# Altium schematic sheet X-M3P1O5__main_V1.0.SchDoc
size 457 x 406 mm
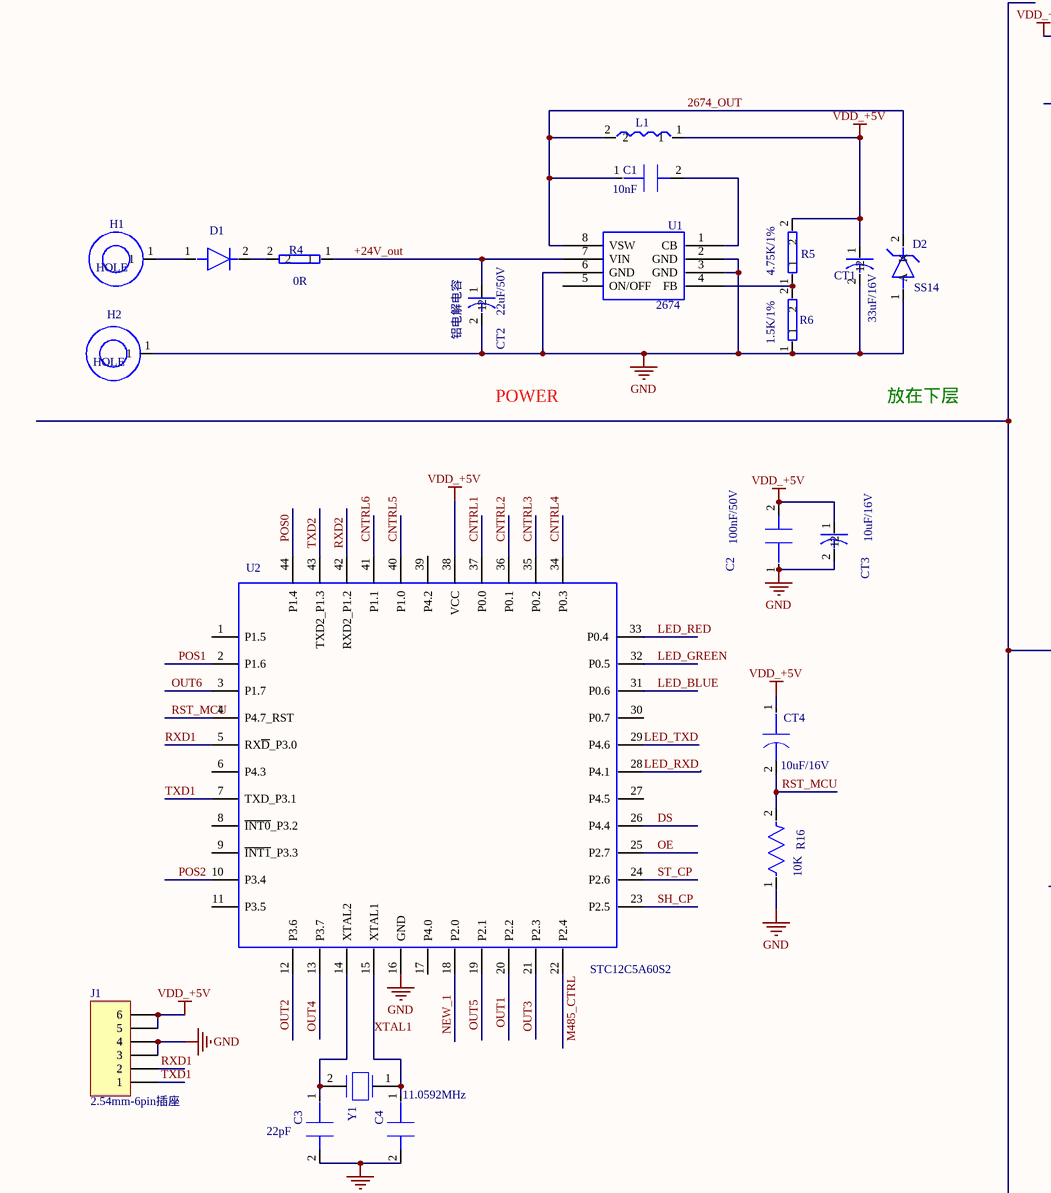
[diagram p0: X-M3P1O5__main_V1.0.SchDoc, top left]
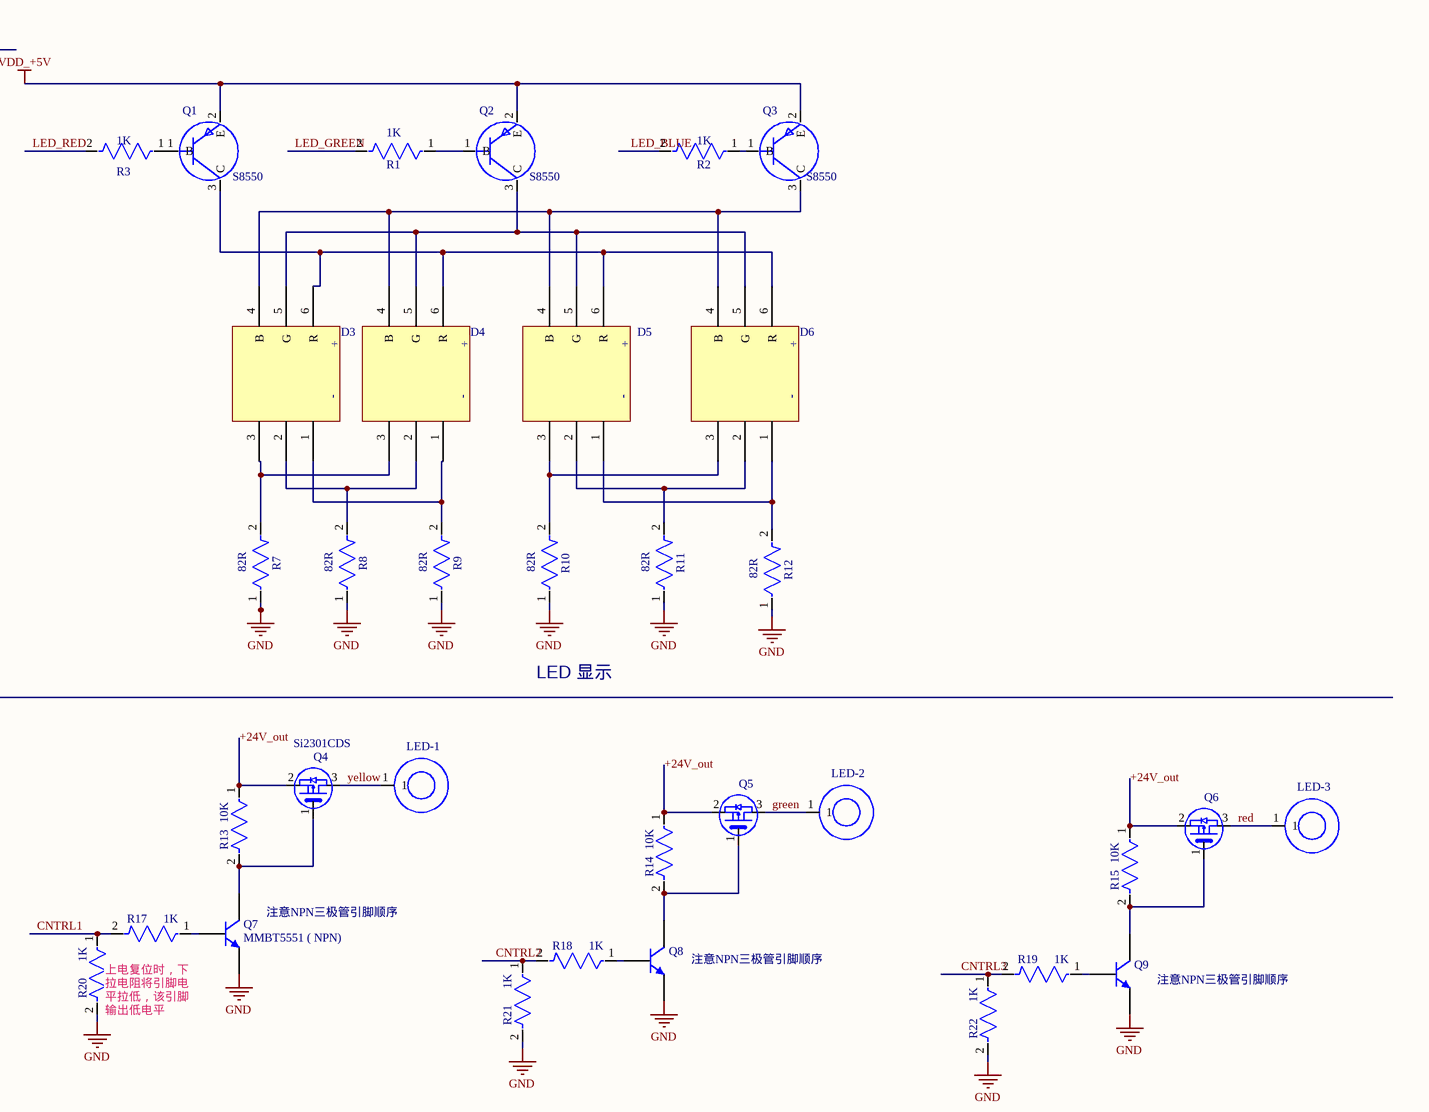
[diagram p1: X-M3P1O5__main_V1.0.SchDoc, top right]
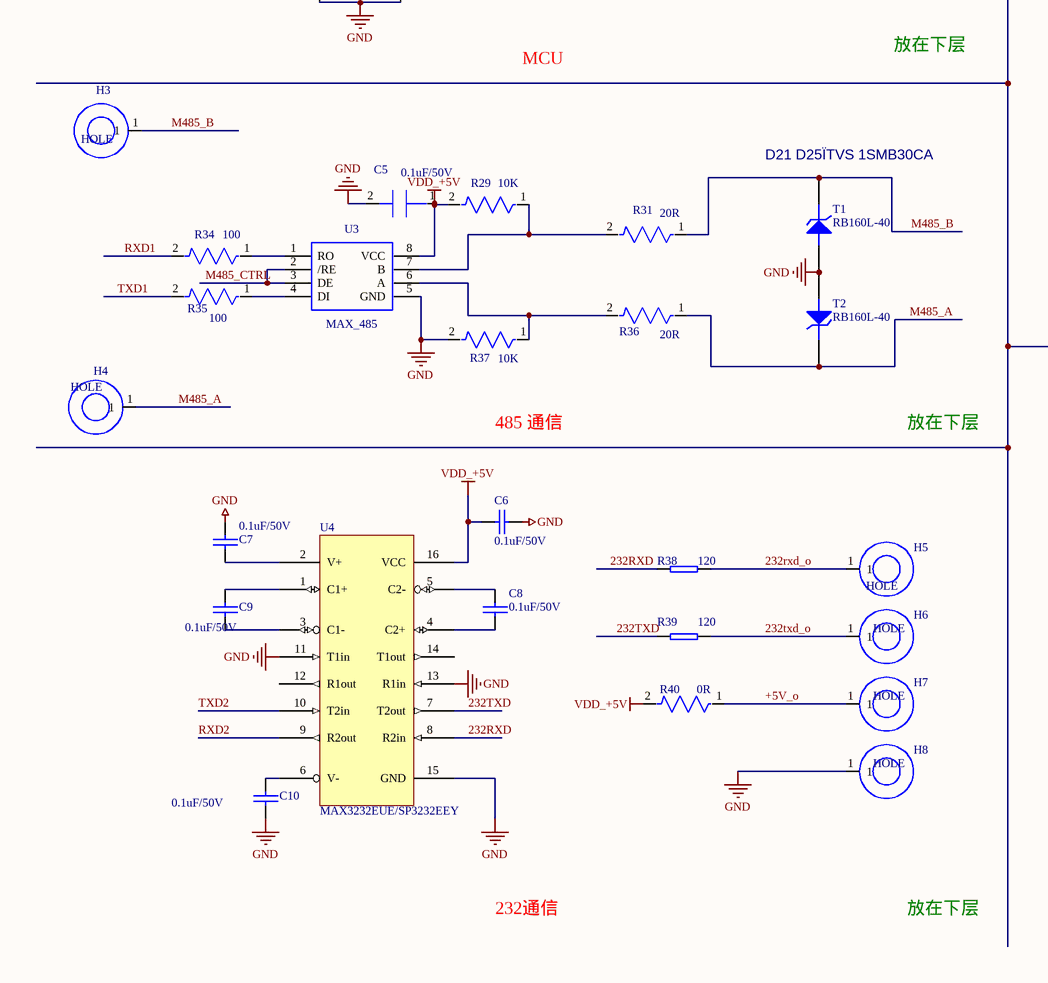
[diagram p2: X-M3P1O5__main_V1.0.SchDoc, bottom left]
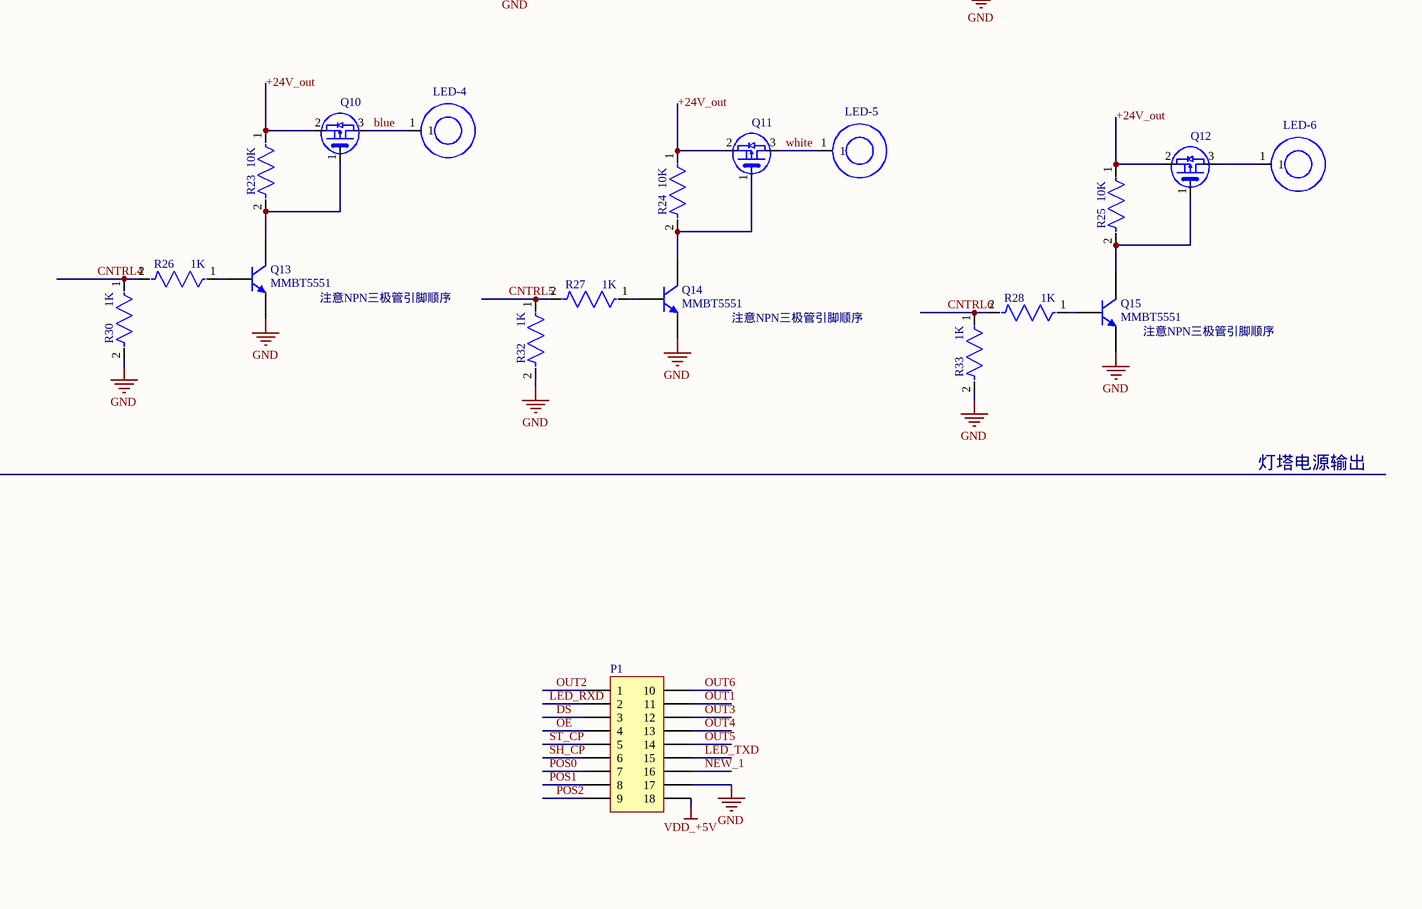
[diagram p3: X-M3P1O5__main_V1.0.SchDoc, bottom right]

## Parts
C1  value 10nF  [C0603]  (hidden comment: CAP0603)
C2  value 100nF/50V  [C0603]  (hidden comment: CAP0603)
C3  value 22pF  [C0603]  (hidden comment: 22pF/50V)
C4  22pF/50V  [C0603]  (value not drawn)
C5  0.1uF/50V  [0603]
C6  0.1uF/50V  [0603]
C7  0.1uF/50V  [0603]
C8  0.1uF/50V  [0603]
C9  0.1uF/50V  [0603]
C10  0.1uF/50V  [0603]
CT1  value 33uF/16V  [CT3528]  (hidden comment: CE)
CT2  铝电解电容  value 22uF/50V  [RB0.1]
CT3  10uF/16V  [1206C]
CT4  10uF/16V  [1206C]
D1  M7  [SMB]  (value not drawn)
D2  SS14  [SMB]
D3  5050RGB  [5050RGB]  (value not drawn)
D4  5050RGB  [5050RGB]  (value not drawn)
D5  5050RGB  [5050RGB]  (value not drawn)
D6  5050RGB  [5050RGB]  (value not drawn)
H1  HOLE  [HOLE_SMD]
H2  HOLE  [HOLE_SMD]
H3  HOLE  [HOLE_SMD]
H4  HOLE  [HOLE_SMD]
H5  HOLE  [HOLE_SMD]
H6  HOLE  [HOLE_SMD]
H7  HOLE  [HOLE_SMD]
H8  HOLE  [HOLE_SMD]
J1  2.54mm-6pin插座  [HDR1X6]
L1  FB  [L-6X6]  (value not drawn)
LED-1  LED_4  [HOLE_SMD]  (value not drawn)
LED-2  LED_4  [HOLE_SMD]  (value not drawn)
LED-3  LED_4  [HOLE_SMD]  (value not drawn)
LED-4  LED_4  [HOLE_SMD]  (value not drawn)
LED-5  LED_4  [HOLE_SMD]  (value not drawn)
LED-6  LED_4  [HOLE_SMD]  (value not drawn)
P1  Header 9X2A  [HDR2X9_CEN]  (value not drawn)
Q1  S8550  [SOT-23]
Q2  S8550  [SOT-23]
Q3  S8550  [SOT-23]
Q4  Si2301CDS  [SOT-23]
Q5  Si2301CDS  [SOT-23]  (value not drawn)
Q6  Si2301CDS  [SOT-23]  (value not drawn)
Q7  MMBT5551 ( NPN)  [SOT-23]
Q8  MMBT5551  [SOT-23]  (value not drawn)
Q9  MMBT5551  [SOT-23]  (value not drawn)
Q10  Si2301CDS  [SOT-23]  (value not drawn)
Q11  Si2301CDS  [SOT-23]  (value not drawn)
Q12  Si2301CDS  [SOT-23]  (value not drawn)
Q13  MMBT5551  [SOT-23]
Q14  MMBT5551  [SOT-23]
Q15  MMBT5551  [SOT-23]
R1  value 1K  [R0603]  (hidden comment: RES0603)
R2  value 1K  [R0603]  (hidden comment: RES0603)
R3  value 1K  [R0603]  (hidden comment: RES0603)
R4  0R  [1206]
R5  4.75K/1%  [R0603]
R6  1.5K/1%  [R0603]
R7  82R  [1206]
R8  82R  [1206]
R9  82R  [1206]
R10  82R  [1206]
R11  82R  [1206]
R12  82R  [1206]
R13  10K  [R0603]
R14  10K  [R0603]
R15  10K  [R0603]
R16  10K  [R0603]
R17  1K  [R0603]
R18  1K  [R0603]
R19  1K  [R0603]
R20  1K  [R0603]
R21  1K  [R0603]
R22  1K  [R0603]
R23  10K  [R0603]
R24  10K  [R0603]
R25  10K  [R0603]
R26  1K  [R0603]
R27  1K  [R0603]
R28  1K  [R0603]
R29  10K  [R0603]
R30  1K  [R0603]
R31  20R  [1206]
R32  1K  [R0603]
R33  1K  [R0603]
R34  100  [R0603]
R35  100  [R0603]
R36  20R  [2010]
R37  10K  [R0603]
R38  120  [R0603]
R39  120  [R0603]
R40  0R  [1206]
T1  RB160L-40  [HSMA]
T2  RB160L-40  [HSMA]
U1  2674  [SO-1.27-9/4.0]
U2  STC12C5A60S2  [STC_LQFP44]
U3  MAX_485  [SO-1.27-8/4.0]
U4  MAX3232EUE/SP3232EEY  [TSOP16]
Y1  11.0592MHz  [49US]

## Nets
GND: C2.1 C3.2 C4.2 C5.2 C6.1 C7.1 C10.1 CT1.2 CT2.2 CT3.2 D2.1(A) H2.1 H8.1 J1.3 J1.4 P1.17 Q7.2(E) Q8.2(E) Q9.2(E) Q13.2(E) Q14.2(E) Q15.2(E) R6.1 R7.1 R8.1 R9.1 R10.1 R11.1 R12.1 R16.1 R20.2 R21.2 R22.2 R30.2 R32.2 R33.2 R37.2 T1.1(A) T2.1(A) U1.2(GND) U1.3(GND) U1.6(GND) U2.16(GND) U3.5(GND) U4.11(T1in) U4.13(R1in) U4.15(GND)
VDD_+5V: C2.2 C5.1 C6.2 CT1.1 CT3.1 CT4.1 J1.5 J1.6 L1.1 P1.18 Q1.2(E) Q2.2(E) Q3.2(E) R5.2 R29.2 R40.2 U2.38(VCC) U3.8(VCC) U4.16(VCC)
232RXD: R38.2 U4.8(R2in)
232rxd_o: H5.1 R38.1
232TXD: R39.2 U4.7(T2out)
232txd_o: H6.1 R39.1
2674_OUT: C1.1 D2.2(K) L1.2 U1.8(VSW)
+5V_o: H7.1 R40.1
+24V_out: CT2.1 Q4.2(S) Q5.2(S) Q6.2(S) Q10.2(S) Q11.2(S) Q12.2(S) R4.1 R13.1 R14.1 R15.1 R23.1 R24.1 R25.1 U1.7(VIN)
blue: LED-4.1 Q10.3(D)
CNTRL1: R17.2 R20.1 U2.37(P0.0)
CNTRL2: R18.2 R21.1 U2.36(P0.1)
CNTRL3: R19.2 R22.1 U2.35(P0.2)
CNTRL4: R26.2 R30.1 U2.34(P0.3)
CNTRL5: R27.2 R32.1 U2.40(P1.0)
CNTRL6: R28.2 R33.1 U2.41(P1.1)
DS: P1.3 U2.26(P4.4)
green: LED-2.1 Q5.3(D)
LED_BLUE: R2.2 U2.31(P0.6)
LED_GREEN: R1.2 U2.32(P0.5)
LED_RED: R3.2 U2.33(P0.4)
LED_RXD: P1.2 U2.28(P4.1)
LED_TXD: P1.15 U2.29(P4.6)
M485_A: H4.1 R36.1 T2.2(K)
M485_B: H3.1 R31.1 T1.2(K)
M485_CTRL: U2.22(P2.4) U3.2(/RE) U3.3(DE)
NEW_1: P1.16 U2.18(P2.0)
OE: P1.4 U2.25(P2.7)
OUT1: P1.11 U2.20(P2.2)
OUT2: P1.1 U2.12(P3.6)
OUT3: P1.12 U2.21(P2.3)
OUT4: P1.13 U2.13(P3.7)
OUT5: P1.14 U2.19(P2.1)
OUT6: P1.10 U2.3(P1.7)
POS0: P1.7 U2.44(P1.4)
POS1: P1.8 U2.2(P1.6)
POS2: P1.9 U2.10(P3.4)
red: LED-3.1 Q6.3(D)
RST_MCU: CT4.2 R16.2 U2.4(P4.7_RST)
RXD1: J1.2 R34.2 U2.5(RX~{D}_P3.0)
RXD2: U2.42(RXD2_P1.2) U4.9(R2out)
SH_CP: P1.6 U2.23(P2.5)
ST_CP: P1.5 U2.24(P2.6)
TXD1: J1.1 R35.2 U2.7(TXD_P3.1)
TXD2: U2.43(TXD2_P1.3) U4.10(T2in)
white: LED-5.1 Q11.3(D)
XTAL1: C4.1 U2.15(XTAL1) Y1.1
yellow: LED-1.1 Q4.3(D)
NetC1_2: C1.2 U1.1(CB)
NetC3_1: C3.1 U2.14(XTAL2) Y1.2
NetC7_2: C7.2 U4.2(V+)
NetC8_1: C8.1 U4.4(C2+)
NetC8_2: C8.2 U4.5(C2-)
NetC9_1: C9.1 U4.1(C1+)
NetC9_2: C9.2 U4.3(C1-)
NetC10_2: C10.2 U4.6(V-)
NetD1_1: D1.1 H1.1
NetD1_2: D1.2 R4.2
NetD3_1: D3.1 D4.1 R9.2
NetD3_2: D3.2 D4.2 R8.2
NetD3_3: D3.3 D4.3 R7.2
NetD3_4: D3.4(B) D4.4(B) D5.4(B) D6.4(B) Q3.3(C)
NetD3_5: D3.5(G) D4.5(G) D5.5(G) D6.5(G) Q2.3(C)
NetD3_6: D3.6(R) D4.6(R) D5.6(R) D6.6(R) Q1.3(C)
NetD5_1: D5.1 D6.1 R12.2
NetD5_2: D5.2 D6.2 R11.2
NetD5_3: D5.3 D6.3 R10.2
NetLED-6_1: LED-6.1 Q12.3(D)
NetQ1_1: Q1.1(B) R3.1
NetQ2_1: Q2.1(B) R1.1
NetQ3_1: Q3.1(B) R2.1
NetQ4_1: Q4.1(G) Q7.3(C) R13.2
NetQ5_1: Q5.1(G) Q8.3(C) R14.2
NetQ6_1: Q6.1(G) Q9.3(C) R15.2
NetQ7_1: Q7.1(B) R17.1
NetQ8_1: Q8.1(B) R18.1
NetQ9_1: Q9.1(B) R19.1
NetQ10_1: Q10.1(G) Q13.3(C) R23.2
NetQ11_1: Q11.1(G) Q14.3(C) R24.2
NetQ12_1: Q12.1(G) Q15.3(C) R25.2
NetQ13_1: Q13.1(B) R26.1
NetQ14_1: Q14.1(B) R27.1
NetQ15_1: Q15.1(B) R28.1
NetR5_1: R5.1 R6.2 U1.4(FB)
NetR29_1: R29.1 R31.2 U3.7(B)
NetR34_1: R34.1 U3.1(RO)
NetR35_1: R35.1 U3.4(DI)
NetR36_2: R36.2 R37.1 U3.6(A)

Not connected (* = marked no-connect by the designer): U1 5(ON/OFF); U2 1(P1.5) 6(P4.3) 8(~{INT0}_P3.2) 9(~{INT1}_P3.3) 11(P3.5) 17(P4.0) 27(P4.5) 30(P0.7) 39(P4.2); U4 12(R1out) 14(T1out)

## Notes on the sheet
- POWER
- 放在下层
- LED 显示
- (near Q7) 注意NPN三极管引脚顺序
- (near Q8) 注意NPN三极管引脚顺序
- (near Q9) 注意NPN三极管引脚顺序
- (near R20) 上电复位时，下拉电阻将引脚电平拉低，该引脚输出低电平
- MCU
- (near T1) D21 D25ΪTVS 1SMB30CA
- 注意NPN三极管引脚顺序
- (near Q15) 注意NPN三极管引脚顺序
- 灯塔电源输出
- 485 通信
- 232通信
- (in symbol 5050RGB) +; -

## Library data of the parts
C1-C4 = CAP0603: SURFACE MOUNT CAPACITOR 0.031 X 0.061 INCHES; Manufacturer #1: IPC SM-782 STD.; Sim.Analog.Order: Model$; PCB DECAL: C0603
C5 = CAP0603: SURFACE MOUNT CAPACITOR 0.031 X 0.061 INCHES; Manufacturer #1: IPC SM-782 STD.; Sim.Analog.Order: Model$; Value: 0.1uF; PCB DECAL: C0603
C6-C10 = CAP: Capacitor
CT2 CT3 = CE: PCB DECAL: CT3528
  CT3: VALUE: 10uF/16V
CT4 = CT: SURFACE MOUNT CAPACITOR 0.048 X 0.079 INCHES; Manufacturer #1: IPC SM-782 STD.; Sim.Analog.Order: Model$; PCB DECAL: CT3528; Value: 10uF/16V
D1 = DIO-MLL34: SURFACE MOUNT DIODE, MELF (SOD-80); Manufacturer #1: IPC SM-782; PCB DECAL: SOD-123; VALUE: IN4004
D2 = DIOZ: PCB DECAL: D1005
J1 = Header 6: Header, 6-Pin; LatestRevisionDate: 17-Jul-2002; LatestRevisionNote: Re-released for DXP Platform.; Publisher: Altium Limited
L1 = FB: VALUE: 100uH; PCB DECAL: L-6X6
LED-1-LED-6 = HOLE: PCB DECAL: HOLE_SMD
P1 = Header 9X2A: Header, 9-Pin, Dual row; LatestRevisionDate: 17-Jul-2002; LatestRevisionNote: Re-released for DXP Platform.; Publisher: Altium Limited
Q1-Q3 = PNP(SOT-23): QUAD AMPLIFIER SWITCHING PNP SILICON TRANSISTOR; Manufacturer #1: MOTOROLA; Part Number: 2N3906; VALUE: FMMT593; PCB DECAL: SOT-23
Q4-Q6 Q10-Q12 = P-MOSFET
Q7-Q9 Q13-Q15 = NPN: NPN Bipolar Transistor; Published: 8-Jun-2000; LatestRevisionDate: 17-Jul-2002; LatestRevisionNote: Re-released for DXP Platform.; PackageReference: TO-226; Publisher: Altium Limited; Code_JEDEC: TO-226-AA
R1-R3 R16 = RES0603: SURFACE MOUNT RESISTOR 0.031 X 0.061 INCHES, 1/10W; Manufacturer #1: IPC SM-782 STD.; Sim.Analog.Prefix: R; Sim.Analog.Order: Model$; PCB DECAL: R0603
  R16: Value: 10K
R4 = RES: VALUE: 4.75K 1%; PCB DECAL: R0603
R5 = RES: VALUE: 4.75K 1%; PCB DECAL: R0603
R6 = RES: VALUE: 1.5K 1%; PCB DECAL: R0603
R7-R12 = RES0603: SURFACE MOUNT RESISTOR 0.031 X 0.061 INCHES, 1/10W; Manufacturer #1: IPC SM-782 STD.; Value: 150R; Sim.Analog.Prefix: R; Sim.Analog.Order: Model$; PCB DECAL: R0603
R13-R15 R17-R28 R30 R32 R33 = RES0603: SURFACE MOUNT RESISTOR 0.031 X 0.061 INCHES, 1/10W; Manufacturer #1: IPC SM-782 STD.; Value: 680R; Sim.Analog.Prefix: R; Sim.Analog.Order: Model$; PCB DECAL: R0603
R29 R34 R35 R37 = RES0603: SURFACE MOUNT RESISTOR 0.031 X 0.061 INCHES, 1/10W; Manufacturer #1: IPC SM-782 STD.; Value: 150R; Sim.Analog.Prefix: R; Sim.Analog.Order: Model$; PCB DECAL: R0603
R31 R36 = RES0603: SURFACE MOUNT RESISTOR 0.031 X 0.061 INCHES, 1/10W; Manufacturer #1: IPC SM-782 STD.; Sim.Analog.Prefix: R; Sim.Analog.Order: Model$; PCB DECAL: R0603; Value: 20R
R38 R39 = Component_1
R40 = RES0603: SURFACE MOUNT RESISTOR 0.031 X 0.061 INCHES, 1/10W; Manufacturer #1: IPC SM-782 STD.; Value: 680R; Sim.Analog.Prefix: R; Sim.Analog.Order: Model$; PCB DECAL: R0603
T1 T2 = ZENER3: Zener Diode
U2 = STC12C5A60S2_LQFP-44: PCB DECAL: LQFP-0.8-32/9X9
U4 = ST3232: RS232 Transceiver
Y1 = XTAL-1: CRYSTAL; Value: 11.0592MHz; PCB DECAL: 49US
CT1 = CE: PCB DECAL: CT3528
H1-H8 = HOLE: PCB DECAL: HOLE_SMD
U1 = 2674: VALUE: 2674; PCB DECAL: SO-1.27-9/4.0
U3 = MAX_485: PCB DECAL: SO-1.27-8/4.0